# EAGLE design batteryboard-v2.2 (EAGLE 9.6.2)
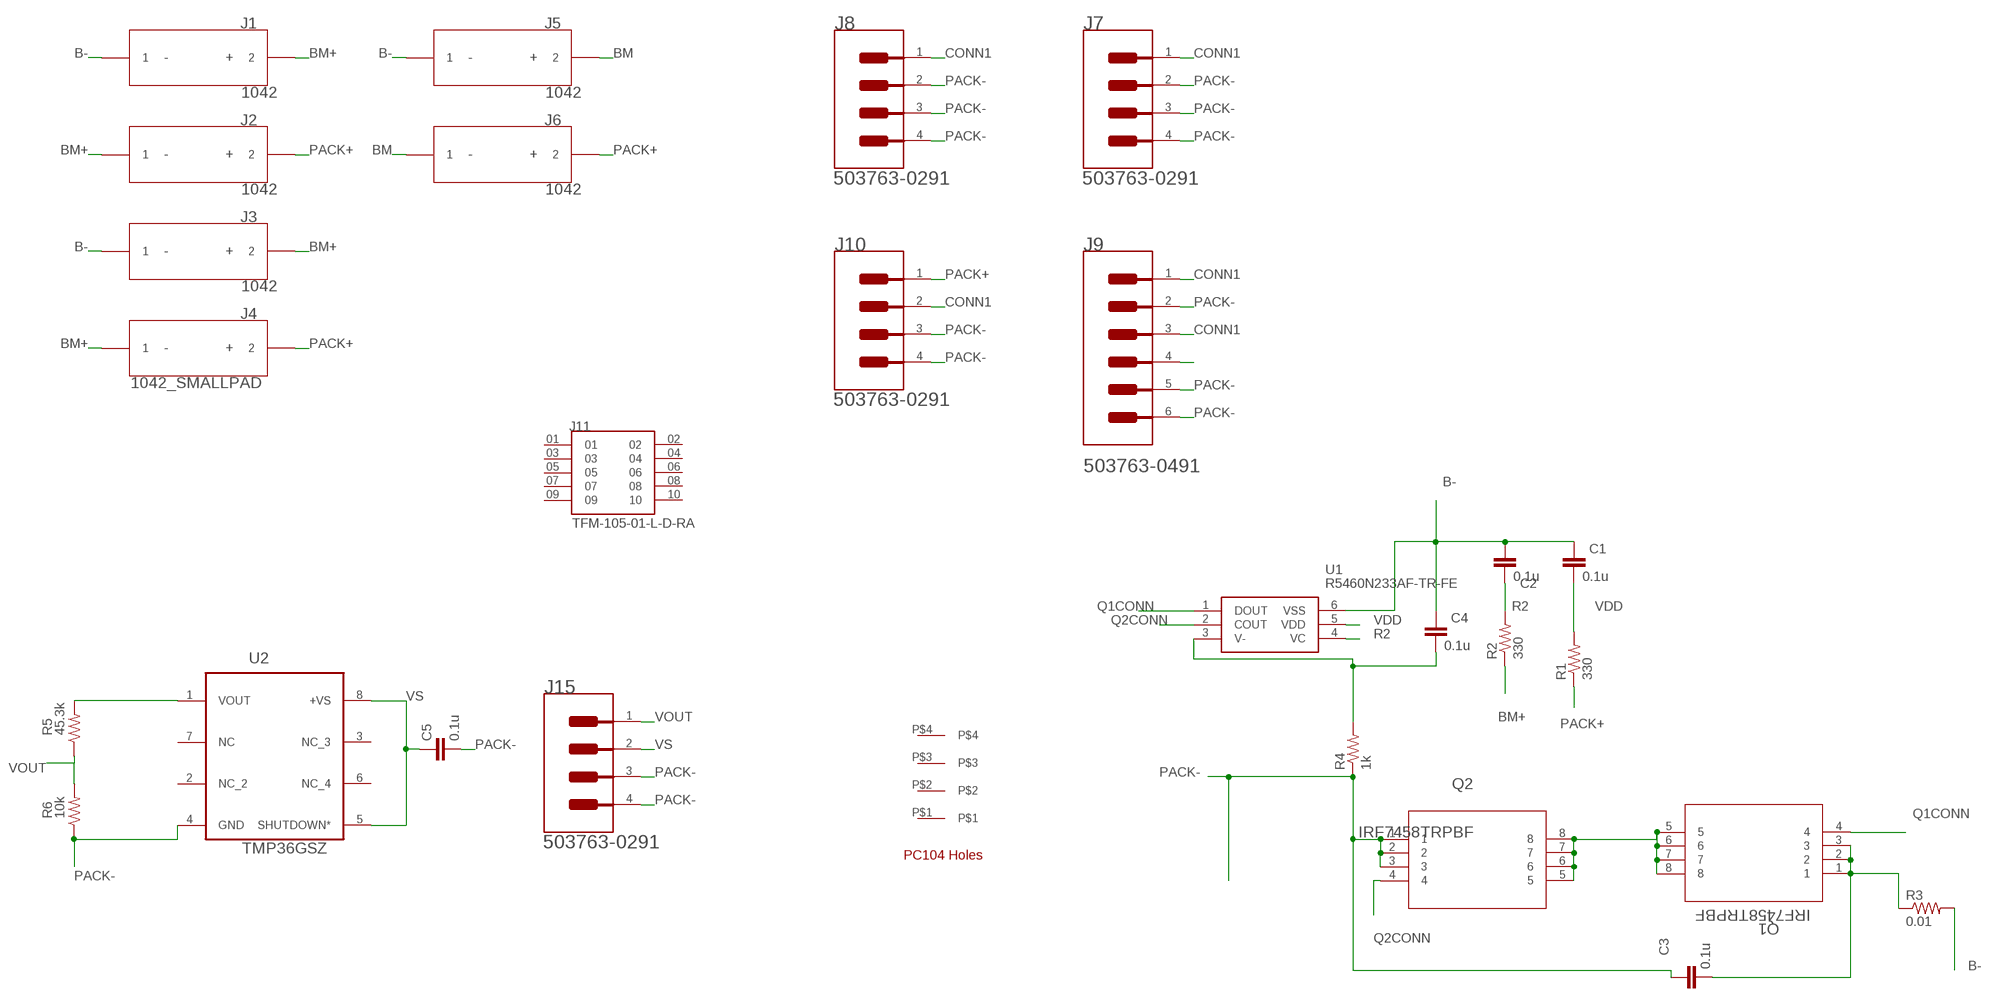
[diagram p0: schematic, sheet 1]

## Parts
C1  0.1u  CAP0603-CAP  [0603-CAP]
C2  0.1u  CAP0603-CAP  [0603-CAP]
C3  0.1u  CAP0603-CAP  [0603-CAP]
C4  0.1u  CAP0603-CAP  [0603-CAP]
C5  0.1u  CAP0805  [0805]
J1  1042  [1042_KEY]
J2  1042  [1042_KEY]
J3  1042  [1042_KEY]
J4  1042_SMALLPAD  [1042_KEY_SMALLPAD]
J5  1042  [1042_KEY]
J6  1042  [1042_KEY]
J7  MOLEX_503763-0291MOLEX_503763-0291_0_0  [MOLEX_503763-0291_0]
J8  MOLEX_503763-0291MOLEX_503763-0291_0_0  [MOLEX_503763-0291_0]
J9  MOLEX_503763-0491MOLEX_503763-0491_0_0  [MOLEX_503763-0491_0]
J10  MOLEX_503763-0291MOLEX_503763-0291_0_0  [MOLEX_503763-0291_0]
J11  TFM-105-01-L-D-RA  [SAMTEC_TFM-105-01-L-D-RA]
J15  MOLEX_503763-0291MOLEX_503763-0291_0_0  [MOLEX_503763-0291_0]
Q1  IRF7458TRPBF  [SO-8_IRF7458_3P9X4P9_INF]
Q2  IRF7458TRPBF  [SO-8_IRF7458_3P9X4P9_INF]
R1  330  RESISTOR0603-RES  [0603-RES]
R2  330  RESISTOR0603-RES  [0603-RES]
R3  0.01  RESISTOR2512  [R2512]
R4  1k  RESISTOR0603-RES  [0603-RES]
R5  45.3k  RESISTOR0805-RES  [0805]
R6  10k  RESISTOR0805-RES  [0805]
U1  R5460N233AF-TR-FE  [SOT95P280X140-6N]
U2  TMP36GSZ  [SOIC127P600X175-8N]
U$1  PC104_HOLES  [PC104_HOLES]

## Nets
B-: C1.1 C2.1 C4.1 J1.1 J3.1 J5.1 R3.2 U1.6(VSS)
BM: J5.2 J6.1
BM+: J1.2 J2.1 J3.2 J4.1 R2.1
CONN1: J7.1 J8.1 J9.1 J9.3 J10.2
N$1: R5.2 U2.1(VOUT)
N$2: C3.2 Q1.1 Q1.2 Q1.3 R3.1
N$4: C4.2 R4.2 U1.3(V-)
N$5: Q1.5 Q1.6 Q1.7 Q1.8 Q2.5 Q2.6 Q2.7 Q2.8
PACK+: J2.2 J4.2 J6.2 J10.1 R1.1
PACK-: C3.1 C5.2 J7.2 J7.3(MNT_1) J7.4(MNT_2) J8.2 J8.3(MNT_1) J8.4(MNT_2) J9.2 J9.4 J9.5(MNT_1) J9.6(MNT_2) J10.3(MNT_1) J10.4(MNT_2) J15.3(MNT_1) J15.4(MNT_2) Q2.1 Q2.2 Q2.3 R4.1 R6.1 U2.4(GND)
Q1CONN: Q1.4 U1.1(DOUT)
Q2CONN: Q2.4 U1.2(COUT)
R2: C2.2 R2.2 U1.4(VC)
VDD: C1.2 R1.2 U1.5(VDD)
VOUT: J15.1 R5.1 R6.2
VS: C5.1 J15.2 U2.5(SHUTDOWN*) U2.8(+VS)
Unconnected: J11.01 J11.02 J11.03 J11.04 J11.05 J11.06 J11.07 J11.08 J11.09 J11.10 U2.2(NC_2) U2.3(NC_3) U2.6(NC_4) U2.7(NC) U$1.P$1 U$1.P$2 U$1.P$3 U$1.P$4

## Library data of the parts
C1-C5 = HSFL_Main_Library (1):CAP: Capacitor Standard 0603 ceramic capacitor, and 0.1" leaded capacitor.
J1-J3 J5 J6 = Keystone_Electronics_1042:1042; COPYRIGHT: Copyright (C) 2021 Ultra Librarian. All rights reserved.; DIGI-KEY_PART_NUMBER_1: 1042L-ND; DIGI-KEY_PART_NUMBER_2: 2991-1042-ND; DIGI-KEY_PART_NUMBER_3: 36-1042-ND; DIGI-KEY_PART_NUMBER_4: KEY1066-ND; MANUFACTURER_PART_NUMBER: 1042; MFR_NAME: Keystone Electronics
J4 = Keystone_Electronics_1042:1042_SMALLPAD
J7 J8 J10 J15 = Molex - 503763-0291:MOLEX_503763-0291: 2 Positions Header Connector 0.039" (1.00mm) Surface Mount, Right Angle Gold; CENTROID_NOT_SPECIFIED: No; DATASHEET: http://www.molex.com/pdm_docs/sd/5037630291_sd.pdf; DIGIKEY_DESCRIPTION: CONN HEADER 1MM R/A 2CKT; DIGIKEY_PART_NUMBER: WM10654CT-ND; LEAD_FREE: yes; MF: Molex; MOUSER_PART_NUMBER: 538-503763-0291; MPN: 503763-0291; PACKAGE: HDR02; PREFIX: J; ROHS: yes; TEMPERATURE_RANGE_HIGH: +105°C; TEMPERATURE_RANGE_LOW: -40°C
J9 = Molex - 503763-0491:MOLEX_503763-0491: Wire-To-Board Connector, Pico-Lock 503763 Series, Surface Mount, Header, 4 Contacts, 1 mm; AUTOMOTIVE: No; CENTROID_NOT_SPECIFIED: No; CONN_GENDER: Male; CONN_ORIENTATION: Right Angle; CONTACT_MATERIAL: Gold,Nickel; CURRENT_RATING: 1.5A; DATASHEET: https://www.molex.com/webdocs/datasheets/pdf/en-us/5037630491_PCB_HEADERS.pdf; DEVICE_CLASS_L1: Connectors; DEVICE_CLASS_L2: Headers and Wire Housings; DEVICE_CLASS_L3: unset; DIGIKEY_DESCRIPTION: CONN HEADER 1MM R/A 4CKT; DIGIKEY_PART_NUMBER: WM10655CT-ND; FOOTPRINT_URL: https://www.molex.com/pdm_docs/sd/5037630491_sd.pdf; FOOTPRINT_VARIANT_NAME_0: Recommended_Land_Pattern; HEIGHT: 1.7mm; LEAD_FREE: Yes; MF: Molex; MFG_PACKAGE_IDENT: 503763-0491; MFG_PACKAGE_IDENT_DATE: 0; MFG_PACKAGE_IDENT_REV: 0; MOUSER_PART_NUMBER: 538-503763-0491; MPN: 503763-0491; NUMBER_OF_CONTACTS: 4; NUMBER_OF_ROWS: 1; PACKAGE: HDR4; PITCH: 1mm; PREFIX: J; ROHS: Yes; TEMPERATURE_RANGE_HIGH: +105°C; TEMPERATURE_RANGE_LOW: -40°C; VERIFICATION_VERSION: 0.0.0.1; VOLTAGE_RATING: 150V
J11 = TFM-105-01-L-D-RA:TFM-105-01-L-D-RA; MANUFACTURER: Samtec; PARTREV: R; STANDARD: Manufacturer Recommendations
Q1 Q2 = IRF7458:IRF7458TRPBF; COPYRIGHT: Copyright (C) 2021 Ultra Librarian. All rights reserved.; MANUFACTURER_PART_NUMBER: IRF7458TRPBF; MFR_NAME: Infineon
R1-R6 = HSFL_Main_Library (1):RESISTOR: Resistor Basic schematic elements and footprints for 0603, 1206, and PTH resistors.
U1 = SamacSys_Parts:R5460N233AF-TR-FE: Battery Management 2-Cell Li-ion Protection IC Source: Datasheet; DESCRIPTION: Battery Management 2-Cell Li-ion Protection IC; HEIGHT: 1.4mm; MANUFACTURER_NAME: Ricoh; MANUFACTURER_PART_NUMBER: R5460N233AF-TR-FE; MOUSER_PART_NUMBER: 848-R5460N233AFTRFE; MOUSER_PRICE-STOCK: https://www.mouser.co.uk/ProductDetail/Ricoh-Electronic-Devices-Company/R5460N233AF-TR-FE?qs=0lQeLiL1qyZJIzN8jBJcMQ%3D%3D
U2 = TMP36GSZ:TMP36GSZ: Voltage Output Temperature Sensors Check prices <https://pricing.snapeda.com/parts/TMP36GSZ/Analog%20Devices/view-part?ref=eda>; AVAILABILITY: In Stock; DESCRIPTION: Temperature Sensor Analog, Local -40°C ~ 125°C 10mV/°C 8-SOIC; MF: Analog Devices; MP: TMP36GSZ; PACKAGE: SOIC-8 Analog Devices; PRICE: None; PURCHASE-URL: https://pricing.snapeda.com/search/part/TMP36GSZ/?ref=eda
U$1 = PC104_holes:PC104_HOLES

## Board
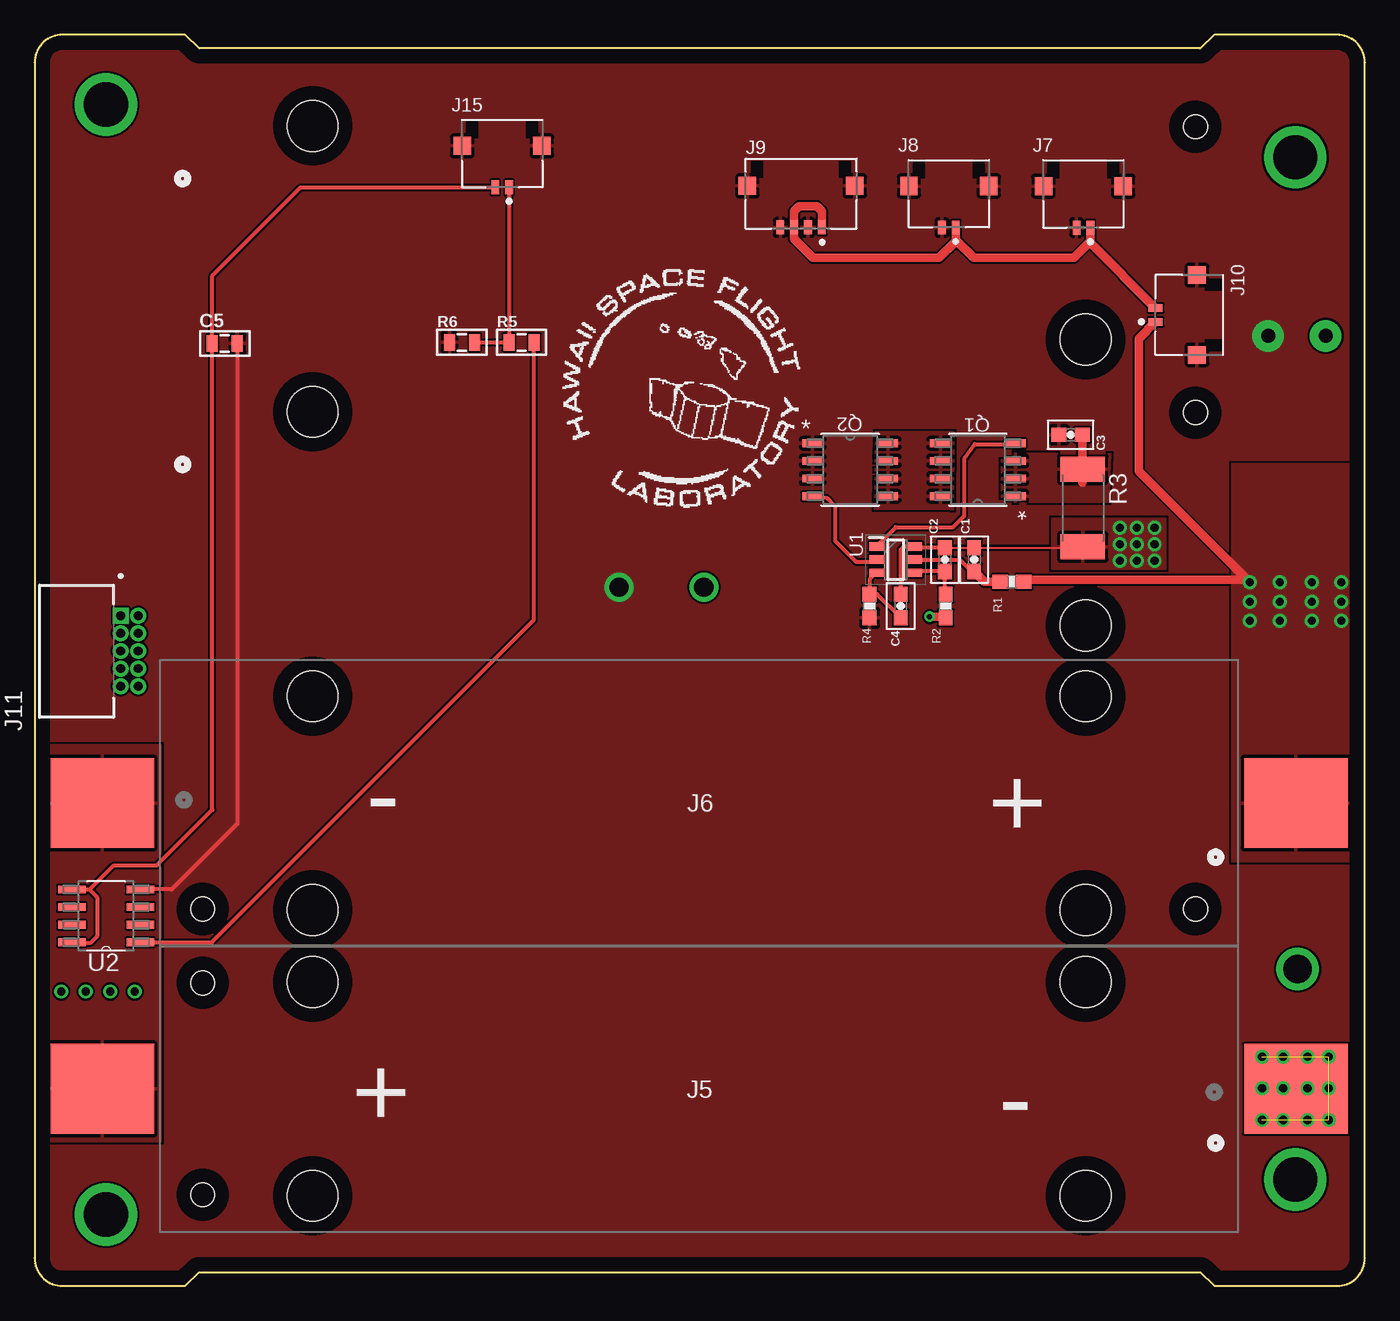
[diagram p1: board, top side]
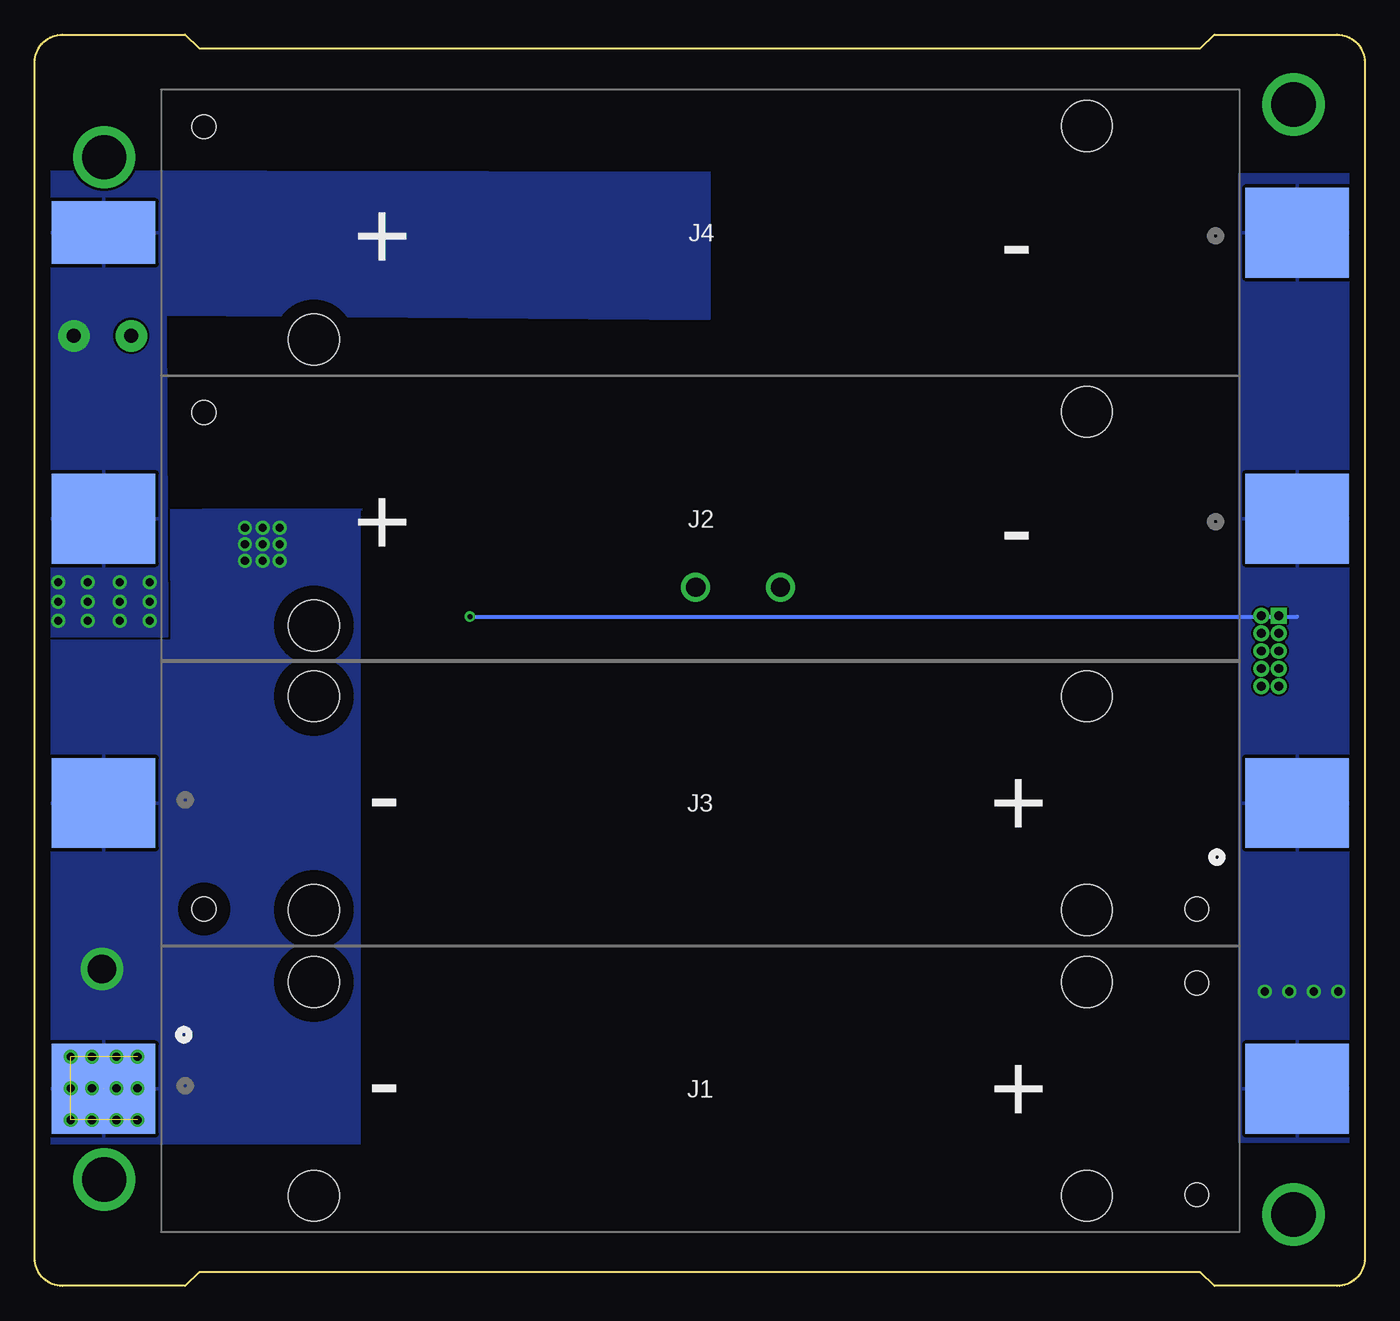
[diagram p2: board, bottom side, seen from below]

Size 95.89 x 90.17 mm. Coordinates in mm from the lower left corner, seen from the top.
Outline: 10.84,0 11.88,0.98 84.02,0.98 85.06,0 93.89,0 arc90 95.89,2 95.89,88.17 arc90 93.89,90.17 85.06,90.17 84.02,89.19 11.88,89.19 10.84,90.17 2,90.17 arc90 0,88.17 0,2 arc90 2,0 10.84,0
Copper layers (1*16): Top 0.035mm / dielectric 1.5mm / Bottom 0.035mm
Design rules "default": minimum track width 6mil, minimum drill 0.35mm, track to track 6mil, track to pad 6mil, pad to pad 6mil, via to via 6mil, smd to smd 6mil, copper to edge 40mil, drill to drill 6mil, minimum pad ring 10mil, minimum via ring 8mil, stop-mask expansion 4mil, vias tented up to drill 0mil, thermal gap 10mil

### Footprints (pad centres in the part's own frame; a part is rotated, then mirrored left to right if it is on the bottom)
0603-CAP = smd 1.1 x 1: 1 -0.85,0; 2 0.85,0
0805 = smd 0.8 x 1.2: 1 -0.9,0; 2 0.9,0
1042_KEY = smd 7.468 x 6.477: 1 -43.02,0; 2 43.02,0 | hole 3.67: -27.865,-7.7; 27.865,7.7 | hole 1.72: 35.785,-7.635
1042_KEY_SMALLPAD = smd 7.468 x 6.477: 1 -43.02,0 | smd 7.468 x 4.5: 2 43.02,0 | hole 3.67: -27.865,-7.7; 27.865,7.7 | hole 1.72: 35.785,-7.635
MOLEX_503763-0291_0 = smd 0.55 x 1: 1 0.5,-2.435; 2 -0.5,-2.435 | smd 1.26 x 1.3: 3 -2.875,0.555; 4 2.875,0.555
MOLEX_503763-0491_0 = smd 0.55 x 1: 1 1.5,-2.435; 2 0.5,-2.435; 3 -0.5,-2.435; 4 -1.5,-2.435 | smd 1.26 x 1.3: 5 -3.875,0.555; 6 3.875,0.555
SAMTEC_TFM-105-01-L-D-RA = drill 0.635 pad 0.985 square: 01 0,0 | drill 0.635 pad 0.985: 02 0,-1.27; 03 -1.27,0; 04 -1.27,-1.27; 05 -2.54,0; 06 -2.54,-1.27; 07 -3.81,0; 08 -3.81,-1.27; 09 -5.08,0; 10 -5.08,-1.27
SO-8_IRF7458_3P9X4P9_INF = smd 1.499 x 0.559: 1 -2.705,1.905; 2 -2.705,0.635; 3 -2.705,-0.635; 4 -2.705,-1.905; 5 2.705,-1.905; 6 2.705,-0.635; 7 2.705,0.635; 8 2.705,1.905
0603-RES = smd 1.1 x 1: 1 -0.85,0; 2 0.85,0
R2512 = smd 1.8 x 3.2: 1 -2.8,0; 2 2.8,0
SOT95P280X140-6N = smd 1 x 0.6: 1 -1.4,0.95; 2 -1.4,0; 3 -1.4,-0.95; 4 1.4,-0.95; 5 1.4,0; 6 1.4,0.95
SOIC127P600X175-8N = smd 1.981 x 0.559: 1 -2.464,1.905; 2 -2.464,0.635; 3 -2.464,-0.635; 4 -2.464,-1.905; 5 2.464,-1.905; 6 2.464,-0.635; 7 2.464,0.635; 8 2.464,1.905
PC104_HOLES = drill 3.2 pad 4.496: P$1 0,0; P$2 80.01,0; P$3 77.47,85.725; P$4 3.81,85.725

### Placement (x,y rotation side)
C1  67.73,52.34 270 top
C2  65.62,52.34 270 top
C3  74.68,61.34 0 top
C4  62.43,49 270 top
C5  13.7,67.92 0 top
J1  47.9,14.2 0 bottom
J2  47.9,55.3 180 bottom
J3  47.9,34.8 0 bottom
J4  47.9,75.9 180 bottom
J5  47.9,14.2 180 top
J6  47.9,34.8 0 top
J7  75.6,78.7 0 top
J8  65.9,78.71 0 top
J9  55.25,78.72 0 top
J10  83.23,69.97 270 top
J11  6.2,48.3 90 top
J15  33.7,81.6 0 top
Q1  67.99,58.82 180 top
Q2  58.79,58.82 0 top
R1  70.45,50.75 180 top
R2  65.67,49 90 top
R3  75.56,56.06 270 top
R4  60.19,49 90 top
R5  35.1,68 0 top
R6  30.8,68 0 top
U1  62.07,52.34 0 top
U2  5.15,26.67 180 top
U$1  5.15,85.15 270 top

### Tracks (layer width: path | path; a pad name or v marks a point on that pad's centre or on a via)
B-  (via drill 0.59 pad 0.38, 2.06 pad 0.99)  (9 unrouted)
  Top 0.152: C2.1 C1.1 74.73,53.19 R3.2
  Top 0.28: C4.1 62.43,53.06 62.66,53.29 U1.6 63.57,53.19 C2.1
  other vias: 93.3,16.52 93.3,14.24 93.3,11.96 91.76,16.52 91.76,14.24 91.76,11.96 90,16.52 90,14.24 90,11.96 88.48,16.52 88.48,11.96 80.73,54.63 80.73,53.45 80.73,52.27 79.46,54.63 79.46,53.45 79.46,52.27 78.22,54.63 78.22,53.45 78.22,52.27 91.05,22.84 88.48,14.24
  pour Top (rank 3): 73.35,55.33 81.52,55.31 81.52,51.65 73.38,51.62
  pour Bottom (rank 3): 72.29,55.98 95.3,55.91 95.3,10.24 72.42,10.29 72.42,55.96
BM
  pour Top: 0.4,10.4 0.4,39 9.1,39 9.1,10.4
BM+  (via drill 0.35 pad 0.6, 0.59 pad 0.38)
  Top 0.6: v64.51,48.23 65.59,48.23 R2.1
  Bottom 0.28: v64.51,48.23 4.88,48.23
  other vias: 1.92,21.22 3.67,21.22 5.45,21.22 7.2,21.22
  pour Bottom: 0.4,10.4 0.4,80.1 9.1,80.1 9.1,10.4
CONN1
  Top 0.61: J9.1 56.75,77.45 56.4,77.8 55.1,77.8 54.75,77.45 J9.3 54.75,75.45 56.1,74.1 65.2,74.1 66.4,75.3 | 66.4,75.3 J8.1 | 66.4,75.3 66.5,75.3 67.7,74.1 74.9,74.1 76.1,75.3 J7.1 76.1,75.17 J10.2
N$1
  Top 0.28: U2.1 12.77,24.77 36,48 R5.2
N$2
  Top 0.6: C3.2 75.53,57.89 R3.1
  pour Top (rank 4): 69.72,60.05 77.55,59.97 77.42,56.9 77.42,56.49 69.72,56.46
N$4
  Top 0.28: C4.2 60.73,49.85 R4.2 60.19,50.91 U1.3
N$5
  Top 0.152: Q2.8 62.01,60.73
  pour Top (rank 4): 66.17,55.96 60.58,55.96 60.63,61.54 66.24,61.54 66.19,55.93
N$8  (via drill 1.39 pad 0.67)
  other vias: 48.24,50.35
PACK+  (via drill 0.59 pad 0.38, 1.01 pad 2.27)
  Top 0.6: 71.35,50.7 R1.1 71.46,50.91 87.39,50.91 v87.61,50.7
  Top 0.61: v87.6,50.7 79.6,58.7 79.6,68.28 J10.1
  other vias: 93.07,68.47 94.19,50.7 94.19,49.31 94.19,47.93 92.06,50.7 92.06,49.31 92.06,47.93 89.77,50.7 89.77,49.31 89.77,47.93 87.6,49.31 87.6,47.93
  pour Bottom: 95.33,46.86 95.24,46.78 86.28,46.83 86.41,70 47.22,69.67 47.19,80.24 95.12,80.34 95.3,46.86
  pour Top (rank 4): 86.35,59.26 95.33,59.26 95.33,30.56 86.35,30.56
PACK-  (via drill 1.01 pad 2.27, 1.39 pad 0.67)
  Top 0.28: C5.2 14.6,33.3 9.88,28.57 U2.4
  other vias: 88.93,68.47 42.12,50.35
  pour Top (rank 6): -0.3,-0.3 -0.3,90.5 96.2,90.5 96.2,-0.3
Q1CONN
  Top 0.28: U1.1 62.07,54.69 66.2,54.69 67.02,55.51 67.02,59.6 67.78,60.66 70.6,60.66 Q1.4
Q2CONN
  Top 0.28: U1.2 60.53,52.2 59.21,52.2 57.71,53.7 57.71,56.18 57.14,56.75 Q2.4
R2
  Top 0.28: 65.62,49.9 C2.2 63.57,51.49 U1.4
  Top 0.6: R2.2 65.62,49.9
VDD
  Top 0.28: C1.2 67.53,51.49 66.68,52.34 U1.5
  Top 0.6: R1.2 68.47,50.75 C1.2
VOUT
  Top 0.28: J15.1 R5.1 R6.2
VS
  Top 0.28: 2.7,28.51 U2.5 | U2.5 3.98,28.57 5.7,30.3 8.8,30.3 12.8,34.3 C5.1 12.8,72.8 19.16,79.17 J15.2 | U2.5 3.92,28.57 4.5,28 4.5,25.2 4,24.7 2.75,24.7 U2.8

### Text on the board
_tsilk: PyCubed.org | J10